# Altium schematic sheet Sheet2.SchDoc
size A3; SheetNumber: 1; SheetTotal: 1
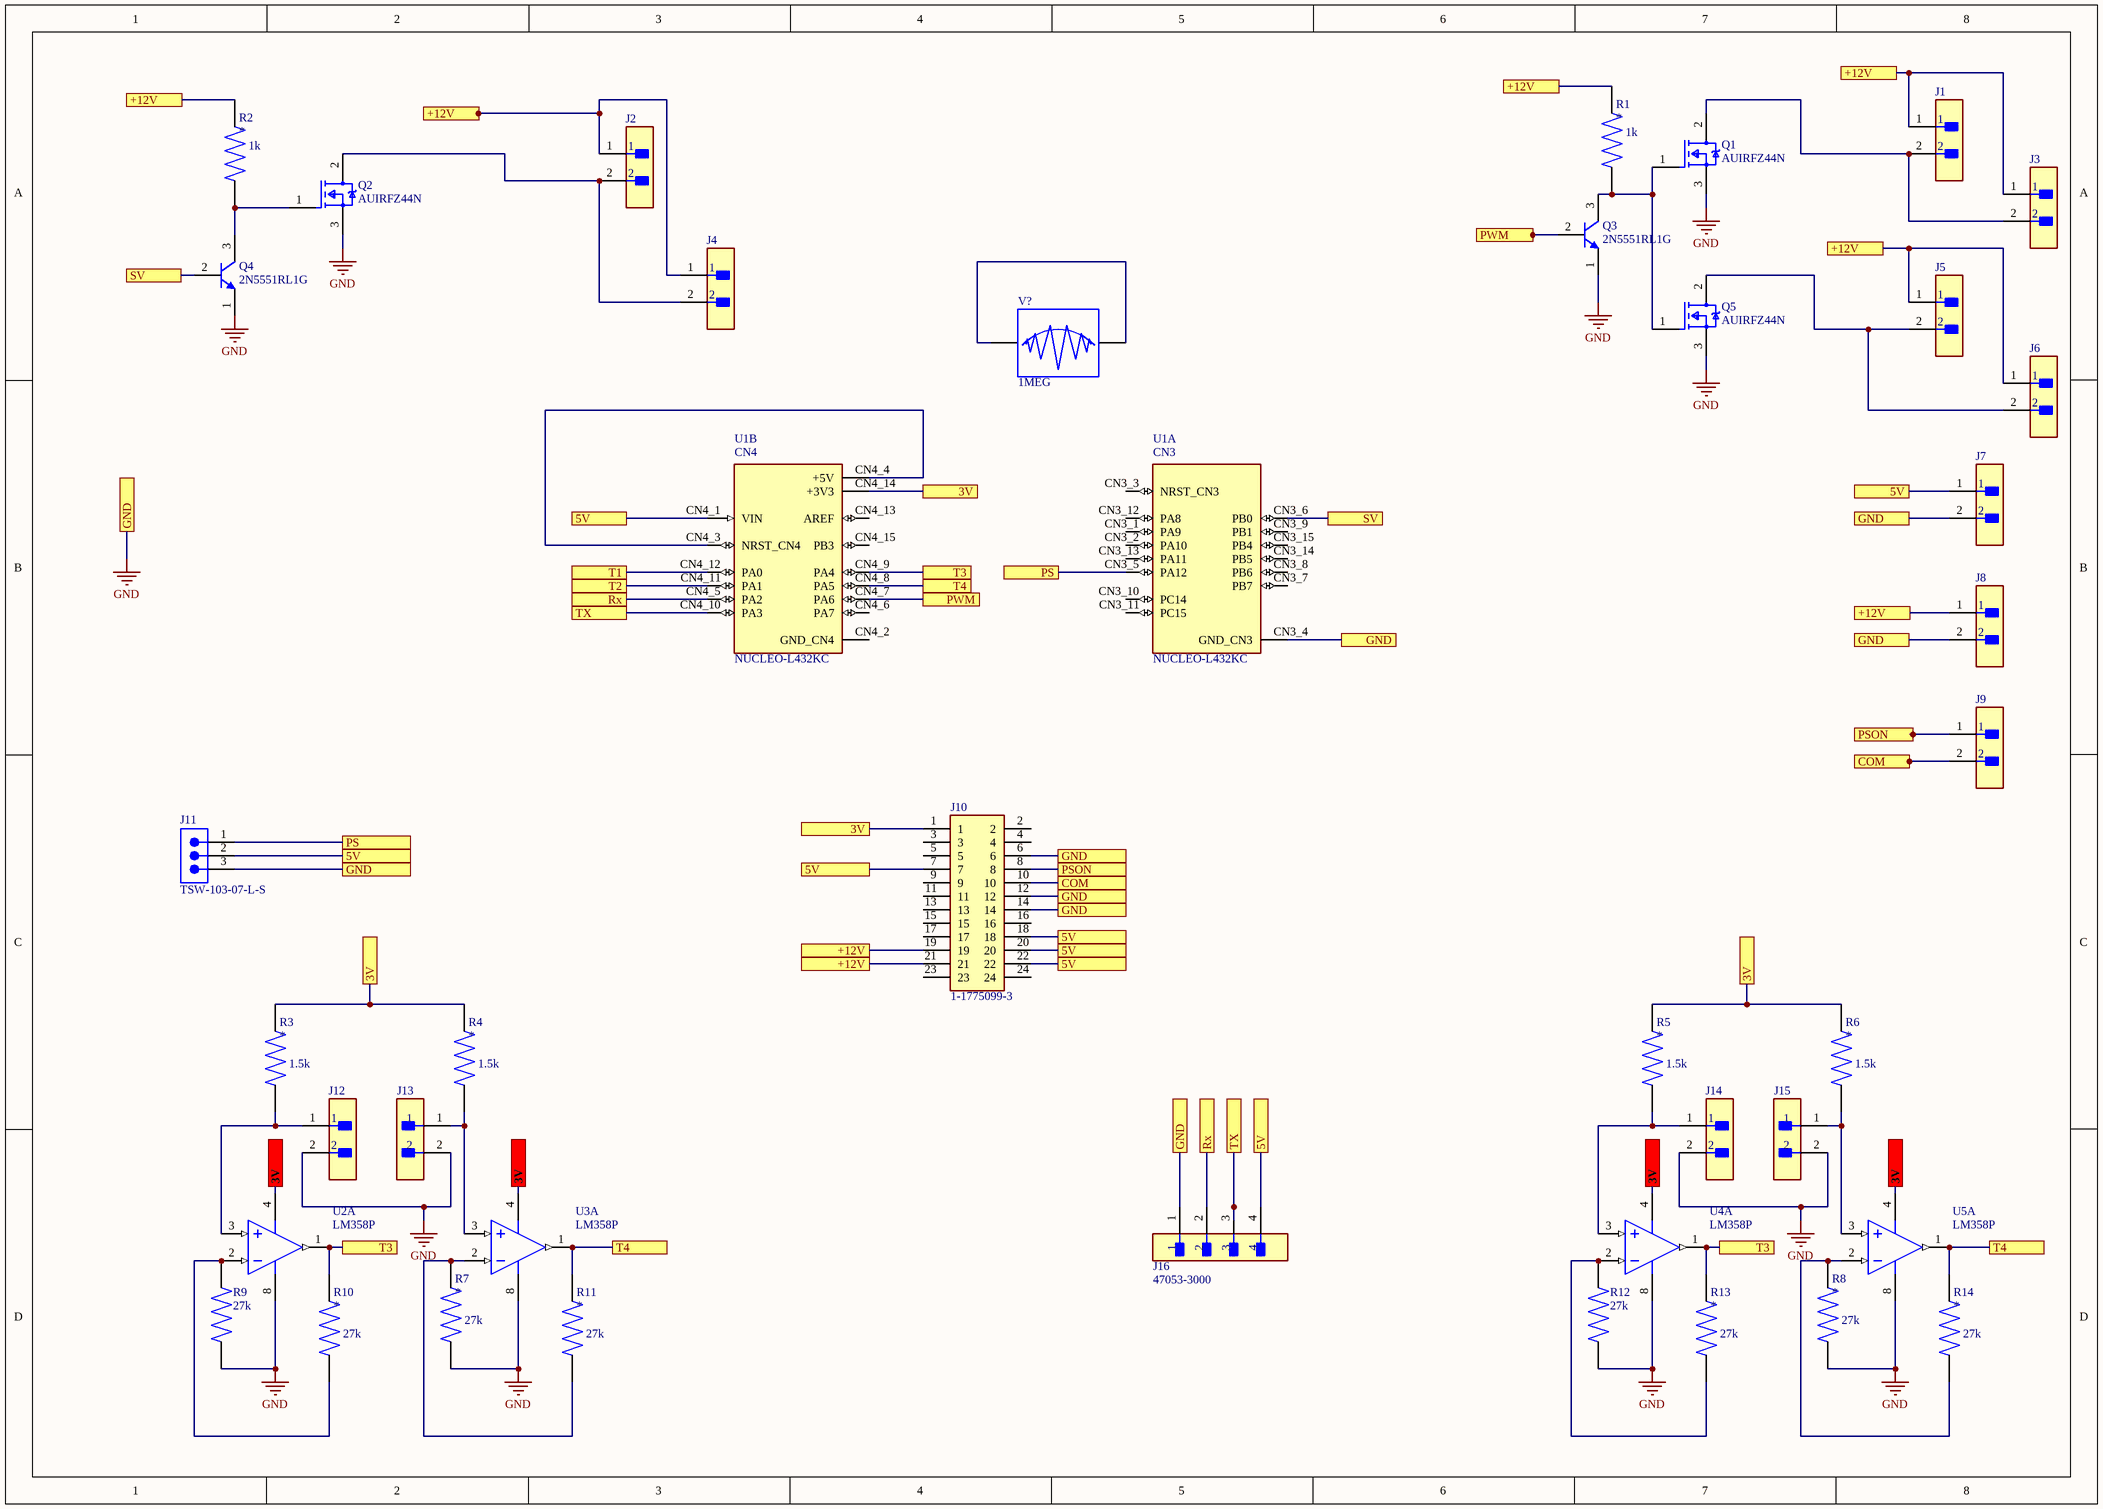
[diagram p0: Sheet2.SchDoc]

## Parts
J1  j10  [FP-TSW-102-07-S-S-MFG]  (value not drawn)
J2  j10  [FP-TSW-102-07-S-S-MFG]  (value not drawn)
J3  j10  [FP-TSW-102-07-S-S-MFG]  (value not drawn)
J4  j10  [FP-TSW-102-07-S-S-MFG]  (value not drawn)
J5  j10  [FP-TSW-102-07-S-S-MFG]  (value not drawn)
J6  j6  [FP-TSW-102-07-S-S-MFG]  (value not drawn)
J7  j10  [FP-TSW-102-07-S-S-MFG]  (value not drawn)
J8  j16  [FP-TSW-102-07-S-S-MFG]  (value not drawn)
J9  J13  [FP-TSW-102-07-S-S-MFG]  (value not drawn)
J10  1-1775099-3  [TE_1-1775099-3]
J11  TSW-103-07-L-S  [SMTC-TSW-103-07-X-S]
J12  j10  [FP-TSW-102-07-S-S-MFG]  (value not drawn)
J13  j11  [FP-TSW-102-07-S-S-MFG]  (value not drawn)
J14  j10  [FP-TSW-102-07-S-S-MFG]  (value not drawn)
J15  j11  [FP-TSW-102-07-S-S-MFG]  (value not drawn)
J16  47053-3000  [FP-47053-3000-MFG]
Q1  AUIRFZ44N  [FP-TO-220AB-MFG]
Q2  AUIRFZ44N  [FP-TO-220AB-MFG]
Q3  2N5551RL1G  [ONSC-TO-92-3-29-11_AM_BL]
Q4  2N5551RL1G  [ONSC-TO-92-3-29-11_AM_BL]
Q5  AUIRFZ44N  [FP-TO-220AB-MFG]
R1  1k  [RESAD1100W55L680D260]
R2  1k  [RESAD1100W55L680D260]
R3  1.5k  [RESAD1100W55L680D260]
R4  1.5k  [RESAD1100W55L680D260]
R5  1.5k  [RESAD1100W55L680D260]
R6  1.5k  [RESAD1100W55L680D260]
R7  27k  [RESAD1100W55L680D260]
R8  27k  [RESAD1100W55L680D260]
R9  27k  [RESAD1100W55L680D260]
R10  27k  [RESAD1100W55L680D260]
R11  27k  [RESAD1100W55L680D260]
R12  27k  [RESAD1100W55L680D260]
R13  27k  [RESAD1100W55L680D260]
R14  27k  [RESAD1100W55L680D260]
U1  NUCLEO-L432KC  [MODULE_NUCLEO-L432KC]  (parts A,B of 2)
U2  LM358P  [P0008A]  (part A of 2)
U3  LM358P  [P0008A]  (part A of 2)
U4  LM358P  [P0008A]  (part A of 2)
U5  LM358P  [P0008A]  (part A of 2)
V?  FC: 1MEG  (hidden comment: Amplitude Modulator Voltage Source)

## Ports
3V, 5V, +12V, COM, GND, PS, PSON, PWM, Rx, SV, T1, T2, T3, T4, TX

## Nets
GND: J7.2 J8.2 J10.6 J10.12 J10.14 J11.3 J12.2 J13.2 J14.2 J15.2 J16.1 Q1.3(S) Q2.3(S) Q3.1(E) Q4.1(E) Q5.3(S) R7.1 R8.1 R9.1 R12.1 U1.CN3_4(GND_CN3) U2.8(VCC) U3.8(VCC) U4.8(VCC) U5.8(VCC) ; port GND
3V: J10.1 R3.2 R4.2 R5.2 R6.2 U1.CN4_14(+3V3) U2.4(GND) U3.4(GND) U4.4(GND) U5.4(GND) ; port 3V
5V: J7.1 J10.7 J10.18 J10.20 J10.22 J11.2 J16.4 U1.CN4_1(VIN) ; port 5V
+12V: J1.1 J2.1 J3.1 J4.1 J5.1 J6.1 J8.1 J10.19 J10.21 R1.2 R2.2 ; port +12V
COM: J9.2 J10.10 ; port COM
PS: J11.1 U1.CN3_5(PA12) ; port PS
PSON: J9.1 J10.8 ; port PSON
PWM: Q3.2(B) U1.CN4_7(PA6) ; port PWM
Rx: J16.2 U1.CN4_5(PA2) ; port Rx
SV: Q4.2(B) U1.CN3_6(PB0) ; port SV
T1: U1.CN4_12(PA0) ; port T1
T2: U1.CN4_11(PA1) ; port T2
T3: R10.2 R13.2 U1.CN4_9(PA4) U2.1(1OUT) U4.1(1OUT) ; port T3
T4: R11.2 R14.2 U1.CN4_8(PA5) U3.1(1OUT) U5.1(1OUT) ; port T4
TX: J16.3 U1.CN4_10(PA3) ; port TX
NetJ1_2: J1.2 J3.2 Q1.2(D)
NetJ2_2: J2.2 J4.2 Q2.2(D)
NetJ5_2: J5.2 J6.2 Q5.2(D)
NetJ12_1: J12.1 R3.1 U2.3(1IN+)
NetJ13_1: J13.1 R4.1 U3.3(1IN+)
NetJ14_1: J14.1 R5.1 U4.3(1IN+)
NetJ15_1: J15.1 R6.1 U5.3(1IN+)
NetQ1_1: Q1.1(G) Q3.3(C) Q5.1(G) R1.1
NetQ2_1: Q2.1(G) Q4.3(C) R2.1
NetR7_2: R7.2 R11.1 U3.2(1IN-)
NetR8_2: R8.2 R14.1 U5.2(1IN-)
NetR9_2: R9.2 R10.1 U2.2(1IN-)
NetR12_2: R12.2 R13.1 U4.2(1IN-)
NetU1_CN4_3: U1.CN4_3(NRST_CN4) U1.CN4_4(+5V)
NetV?_1: V?.1(IN) V?.2(OUT)

Not connected (* = marked no-connect by the designer): J10 2 3 4 5 9 11 13 15 16 17 23 24; U1 CN3_1(PA9) CN3_2(PA10) CN3_3(NRST_CN3) CN3_7(PB7) CN3_8(PB6) CN3_9(PB1) CN3_10(PC14) CN3_11(PC15) CN3_12(PA8) CN3_13(PA11) CN3_14(PB5) CN3_15(PB4) CN4_2(GND_CN4) CN4_6(PA7) CN4_13(AREF) CN4_15(PB3)

## Notes on the sheet
- (in symbol NUCLEO-L432KC, part A) CN3
- (in symbol NUCLEO-L432KC, part B) CN4

## Library data of the parts
J1-J9 J12-J15 = CMP-1681-00004-5: CONN HEADER VERT 2POS 2.54MM; Number of Positions: 2; Max Voltage Rating (AC): 550V; Max Current Rating: 7.6A; Gender: Male; Contact Type: Male Pin; REACH SVHC: No SVHC; Connector Type: Header; Number of Rows: 1; Flammability Rating: UL94 V-0; Pitch: 2.54mm; Orientation: Straight; Termination: Solder; Insulation Material: PBT; RoHS Compliant: Yes; Housing Color: Black; Mount: Through Hole; Contact Mating Length: 0.23inch; Contact Shape: Square; Contact Material: Bronze; Min Operating Temperature: -55°C; Number of Contacts: 2; Depth: 2.54mm; Housing Material: Polyester; Packaging: Bulk; Length: 5.08mm; Radiation Hardening: No; Insulation Color: Black; Series: TSW; Color: Black; Max Operating Temperature: 125°C; Package Quantity: 1; Fastening Type: Pull; Contact Plating: Gold; Lead Free: Lead Free; Contact Finish - Mating: GOLD; Width: 2.54mm
J10 = 1-1775099-3: Conn Power PL 24 POS 4.2mm Solder ST Thru-Hole 24 Terminal 1 Port Box/Tray; Centerline_Pitch: 4.2 mm[.165 in]; MF: TE Connectivity; Product_Type: Connector; Number_of_Positions: 24; MP: 1-1775099-3; Package: None; Digi-Key_Purchase_URL: https://www.digikey.com.au/product-detail/en/te-connectivity-amp-connectors/1-1775099-3/A127799-ND/5272985?utm_source=snapeda&utm_medium=aggregator&utm_campaign=symbol; Digi-Key_Part_Number: A127799-ND; SnapEDA_Link: https://www.snapeda.com/parts/1-1775099-3/TE%20Connectivity%20AMP%20Connectors/view-part/890778/?ref=snap; Value: *; TE_purchase_URL: https://www.te.com/usa-en/product-1-1775099-3.html?te_bu=Cor&te_type=disp&te_campaign=seda_glo_cor-seda-global-disp-prtnr-fy19-seda-model-bom-cta_sma-317_1&elqCampaignId=32493
J11 = CMP-1024-00334-1: 0.025" SQ Post Header, Through-hole, Vertical, -55 to 125 degC, 2.54 mm Pitch, 3-Pin, Male, RoHS; Manufacturer: Samtec; Pitch: 2.54 mm; Mounting Technology: Through-hole; ComponentLink2URL: http://www.samtec.com/documents/webfiles/pdf/TSW_TH.PDF; ComponentLink3Description: Package Specification; PackageVersion: DM, 8/1988; PartNumber: TSW-103-07-L-S; PackageReference: TSW-103-07-X-S; Orientation: Vertical; ComponentLink1URL: http://www.samtec.com; PackageDescription: .025[0.64] SQ. Post Terminal Strip Assembly; ComponentLink1Description: Manufacturer URL; ComponentLink2Description: Datasheet; ComponentLink3URL: http://www.samtec.com/documents/webfiles/cpdf/TSW-XXX-XX-XXX-X-XX-XXX-MKT.pdf; RoHS: True; DatasheetVersion: F-214; Temperature Range: -55 to 125 degC
J16 = CMP-04776-000447-1: CONN HEADER VERT 4POS 2.54MM; Glow Wire Compliant: Non-compliant; Voltage Rating: 250V; Current Rating: 4A; Number of Circuits: 4; Gender: Male; Orientation: Straight; Packaging: Bulk; Series: 47053; RoHS Compliant: Yes; Termination: Through Hole; Contact Plating: Tin; Mount: Through Hole; Number of Rows: 1; Pitch: 2.54mm; Halogen Free: Low Halogen; Number of Contacts: 4; Min Operating Temperature: 0°C; Package Quantity: 12000; Contact Material: Copper Alloy; Max Operating Temperature: 75°C; REACH SVHC: No SVHC; Number of Positions: 4
Q1 Q2 Q5 = CMP-00196-65872631-1: AUIRFZ44N Automotive Q101 55V Single N-Channel HEXFET Power MOSFET in a TO-220AB Package, TO220-3, RoHS; Turn-On Delay Time: 7.3ns; Continuous Drain Current (ID): 49A; Max Power Dissipation: 94W; Fall Time: 60ns; On-State Resistance: 17.5mΩ; Number of Elements: 1; Turn-Off Delay Time: 44ns; Input Capacitance: 1.47nF; Threshold Voltage: 2V; Gate to Source Voltage (Vgs): 20V; Rise Time: 69ns; Max Junction Temperature (Tj): 175°C; Height: 16.51mm; Number of Pins: 3; Drain to Source Voltage (Vdss): 55V; Width: 4.82mm; Length: 10.66mm; NexarPartId: 65872631; REACH SVHC: No SVHC; Mount: Surface Mount, Through Hole; Contact Plating: Tin; Case/Package: TO-220AB; Package Quantity: 1000; Radiation Hardening: No; Power Dissipation: 94W; Element Configuration: Single; Schedule B: 8541290080, 8541290080; RoHS: Compliant; Lifecycle Status: Obsolete; Number of Channels: 1; Drain to Source Breakdown Voltage: 55V; Max Operating Temperature: 175°C; Rds On Max: 17.5mΩ; Drain to Source Resistance: 17.5mΩ; Min Operating Temperature: -55°C
Q3 Q4 = CMP-1048-01479-1: Amplifier Transistor, NPN Silicon, 3-Pin TO-92, Pb-Free, Tape and Reel; Manufacturer: On Semiconductor; fT Min (MHz): 100; IC Continuous (A): 0.6; ComponentLink3Description: Package Specification; PackageDescription: 3-Pin Transistor Outline, Body 4.825 x 3.685 mm, Pitch 1.27 mm; ComponentLink1Description: Manufacturer URL; Mounting Technology: Through Hole; Packing: Tape and Reel; PartNumber: 2N5551RL1G; ComponentLink3URL: http://www.onsemi.com/pub_link/Collateral/MAC97-D.PDF; PackageReference: TO-92-3-29-11_AM_BL; ComponentLink2Description: Datasheet; PackageVersion: Rev. AM; DatasheetVersion: Rev. 5; ComponentLink1URL: http://www.onsemi.com/; RoHS: TRUE; ComponentLink2URL: http://www.onsemi.com/pub_link/Collateral/2N5550-D.PDF; Polarity: NPN
R1-R14 = MFR-25FBF52-1K: 1.07 kOhms Â±1% 0.25W, 1/4W Through Hole Resistor Axial - Metal Film; MF: Yageo; Value: *; SnapEDA_Link: https://www.snapeda.com/parts/MFR-25FBF52-1K/Yageo/view-part/?ref=snap; Purchase-URL: https://pricing.snapeda.com/search/part/MFR-25FBF52-1K/?ref=eda; Availability: In Stock; Price: None; Package: Axial Yageo; Check_prices: https://www.snapeda.com/parts/MFR-25FBF52-1K/Yageo/view-part/?ref=eda; MP: MFR-25FBF52-1K
U1 = NUCLEO-L432KC: STM32 Nucleo-32 development board with STM32L432KC MCU, supports Arduino connectivity; Package: None; Price: None; Availability: Unavailable; MP: NUCLEO-L432KC; Value: *
U2-U5 = CMP-2000-06549-1: Dual Operational Amplifier, 3 to 32 V, 0 to 70 degC, 8-Pin PDIP (P), RoHS, Tape and Reel; Manufacturer: Technik Industrial; Datasheet Version: Rev. T, 04/2015; Datasheet URL: http://www.ti.com/lit/ds/symlink/lm358.pdf; Manufacturer URL: http://www.technik.com.hk/; Package Description: 8-Pin Double In-line Package, Body 9.59 x 6.35 mm, Pitch 2.54 mm; Mounting Technology: ThroughHole; Package URL: http://www.ti.com/lit/ml/mpdi001b/mpdi001b.pdf; Package Reference: P8
V? = AM: SimulationGenericComponent: True; VC: 1; KA: 1; OFFSET: 1